# Altium schematic sheet 基于51单片机万年历电子设计系统.SchDoc
size A4
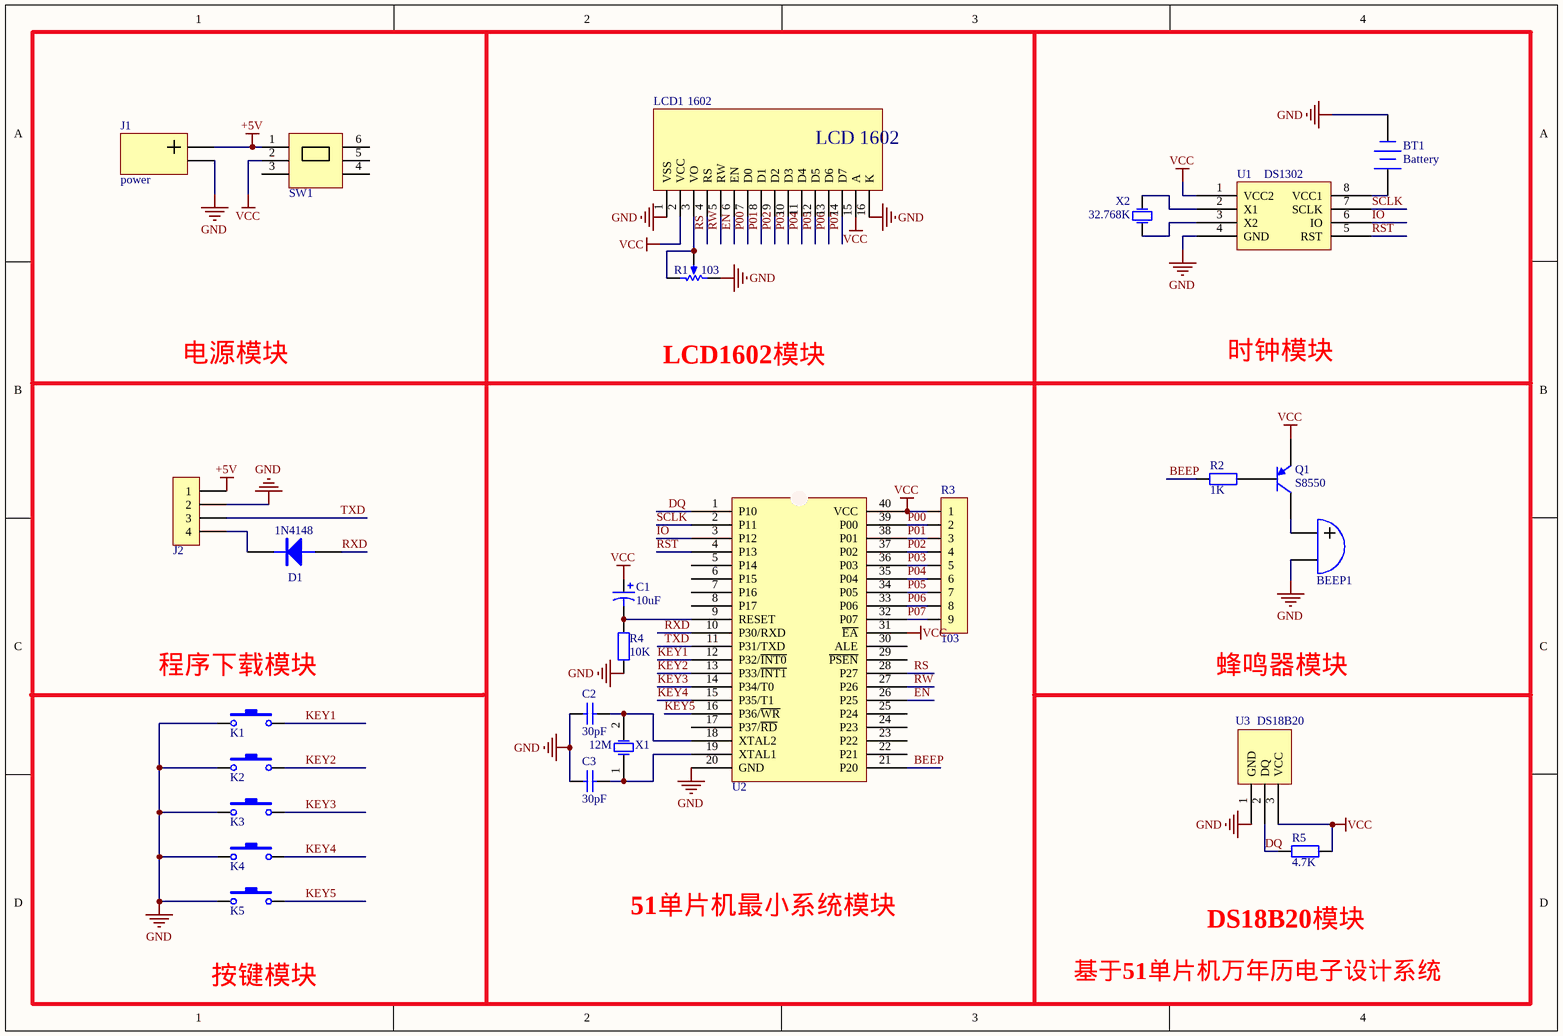
[diagram p0: 基于51单片机万年历电子设计系统.SchDoc]

## Parts
BEEP1  BEEP  [BEEP]  (value not drawn)
BT1  Battery  [CR-2032]
C1  10uF  [CAP_2]
C2  30pF  [CAP]
C3  30pF  [CAP]
D1  1N4148  [1N4148]
J1  power  [DC3.5]
J2  SENSOR  [SIP4]  (value not drawn)
K1  KEY  [SW2]  (value not drawn)
K2  KEY  [SW2]  (value not drawn)
K3  KEY  [SW2]  (value not drawn)
K4  KEY  [SW2]  (value not drawn)
K5  KEY  [SW2]  (value not drawn)
LCD1  1602  [1602]
Q1  S8550  [PNP]
R1  103  [RES-B]
R2  1K  [RES]
R3  103  [SIP9]
R4  10K  [RES]
R5  4.7K  [RES]
SW1  SWT  [SWT]  (value not drawn)
U1  DS1302  [DIP8]
U2  STC89C52  [DIP40]  (value not drawn)
U3  DS18B20  [DS18B20]
X1  12M  [JZ]
X2  32.768K  [XTAL2]

## Nets
+5V: J1.1 J2.1 SW1.1
GND: BEEP1.2 BT1.2(-) C2.1 C3.1 J1.2 J2.2 K1.1 K2.1 K3.1 K4.1 K5.1 LCD1.1(VSS) LCD1.16(K) R1.1 R4.1 U1.4(GND) U2.20(GND) U3.1(GND)
VCC: C1.1 LCD1.2(VCC) LCD1.15(A) Q1.E R3.1 R5.1 SW1.2 U1.1(VCC2) U2.31(~{EA}) U2.40(VCC) U3.3(VCC)
BEEP: R2.2 U2.21(P20)
DQ: R5.2 U2.1(P10) U3.2(DQ)
EN: LCD1.6(EN) U2.26(P25)
IO: U1.6(IO) U2.3(P12)
KEY1: K1.2 U2.12(P32/~{INT0})
KEY2: K2.2 U2.13(P33/~{INT1})
KEY3: K3.2 U2.14(P34/T0)
KEY4: K4.2 U2.15(P35/T1)
KEY5: K5.2 U2.16(P36/~{WR})
P00: LCD1.7(D0) R3.2 U2.39(P00)
P01: LCD1.8(D1) R3.3 U2.38(P01)
P02: LCD1.9(D2) R3.4 U2.37(P02)
P03: LCD1.10(D3) R3.5 U2.36(P03)
P04: LCD1.11(D4) R3.6 U2.35(P04)
P05: LCD1.12(D5) R3.7 U2.34(P05)
P06: LCD1.13(D6) R3.8 U2.33(P06)
P07: LCD1.14(D7) R3.9 U2.32(P07)
RS: LCD1.4(RS) U2.28(P27)
RST: U1.5(RST) U2.4(P13)
RW: LCD1.5(RW) U2.27(P26)
RXD: D1.1(A) U2.10(P30/RXD)
SCLK: U1.7(SCLK) U2.2(P11)
TXD: J2.3 U2.11(P31/TXD)
NetBEEP1_1: BEEP1.1 Q1.C
NetBT1_1: BT1.1(+) U1.8(VCC1)
NetC1_2: C1.2 R4.2 U2.9(RESET)
NetC2_2: C2.2 U2.18(XTAL2) X1.2(OSC2)
NetC3_2: C3.2 U2.19(XTAL1) X1.1(OSC1)
NetD1_2: D1.2(K) J2.4
NetLCD1_3: LCD1.3(VO) R1.2 R1.3
NetQ1_B: Q1.B R2.1
NetU1_2: U1.2(X1) X2.2(OSC2)
NetU1_3: U1.3(X2) X2.1(OSC1)

Not connected (* = marked no-connect by the designer): SW1 3(2) 4(3) 5(4) 6(5); U2 5(P14) 6(P15) 7(P16) 8(P17) 17(P37/~{RD}) 22(P21) 23(P22) 24(P23) 25(P24) 29(~{PSEN}) 30(ALE)

## Notes on the sheet
- 电源模块
- LCD1602模块
- 时钟模块
- (near K1) 程序下载模块
- 蜂鸣器模块
- 51单片机最小系统模块
- 按键模块
- 基于51单片机万年历电子设计系统
- DS18B20模块
- (in symbol 1602) LCD 1602

## Library data of the parts
C1 = CAP_2
C2 C3 = CAP
J1 = DC5.5
J2 = CON4
Q1 = PNP
R1 = RES-B
R2 R4 R5 = Res
R3 = Header9
X1 X2 = XTAL